# Altium project MAX7219_PCB.PrjPCB
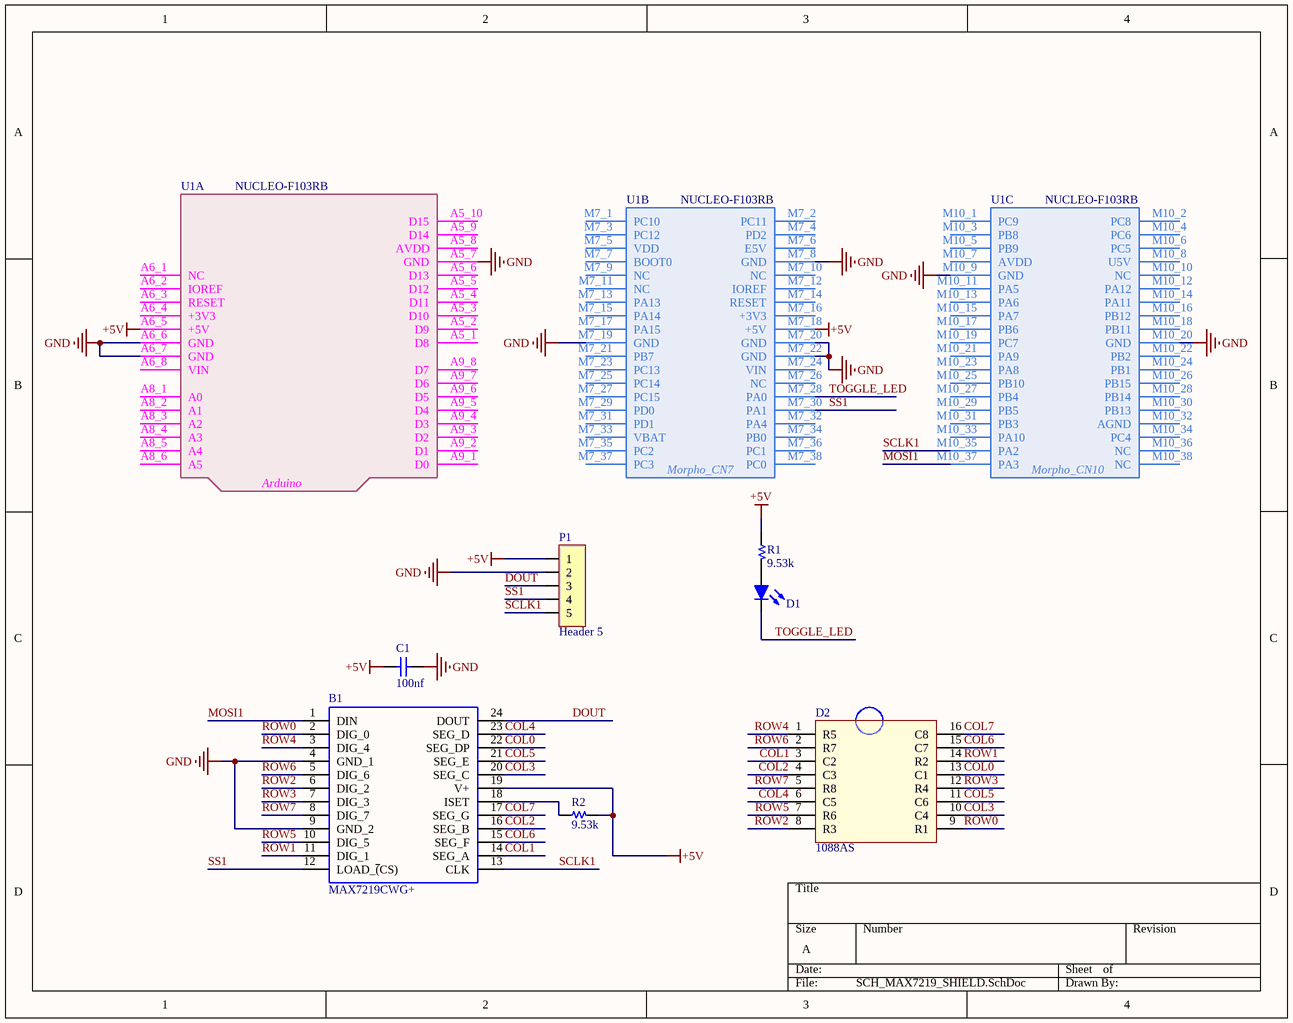
[diagram p0: SCH_MAX7219_SHIELD.SchDoc]
1 sheet, 8 parts. Net scope: global (net labels, ports and power ports of the same name join across sheets).
Board file: PCB_MAX7219_SHIELD.PcbDoc

## Sheet SCH_MAX7219_SHIELD.SchDoc
size A

### Parts
B1  MAX7219CWG+  [SOIC127P1032X265-24N]
C1  100nf  [CAP Ceramic/W300]
D1  Led  [Led 0805]  (value not drawn)
D2  1088AS  [LED/MATRIX/1088]
P1  Header 5  [HDR/Header/5]
R1  9.53k  [R 0805]
R2  9.53k  [R 0805]
U1  NUCLEO-F103RB  [NUCLEO]  (parts A,B,C of 3)

### Nets
+5V: B1.19(V+) C1.2 P1.1 R1.1 R2.2 U1.A6_5(+5V) U1.M7_18(+5V)
GND: B1.4(GND_1) B1.9(GND_2) C1.1 P1.2 U1.A5_7(GND) U1.A6_6(GND) U1.A6_7(GND) U1.M7_8(GND) U1.M7_19(GND) U1.M7_20(GND) U1.M7_22(GND) U1.M10_9(GND) U1.M10_20(GND)
COL0: B1.22(SEG_DP) D2.13(C1)
COL1: B1.14(SEG_A) D2.3(C2)
COL2: B1.16(SEG_B) D2.4(C3)
COL3: B1.20(SEG_C) D2.10(C4)
COL4: B1.23(SEG_D) D2.6(C5)
COL5: B1.21(SEG_E) D2.11(C6)
COL6: B1.15(SEG_F) D2.15(C7)
COL7: B1.17(SEG_G) D2.16(C8)
DOUT: B1.24(DOUT) P1.3
MOSI1: B1.1(DIN) U1.M10_37(PA3)
ROW0: B1.2(DIG_0) D2.9(R1)
ROW1: B1.11(DIG_1) D2.14(R2)
ROW2: B1.6(DIG_2) D2.8(R3)
ROW3: B1.7(DIG_3) D2.12(R4)
ROW4: B1.3(DIG_4) D2.1(R5)
ROW5: B1.10(DIG_5) D2.7(R6)
ROW6: B1.5(DIG_6) D2.2(R7)
ROW7: B1.8(DIG_7) D2.5(R8)
SCLK1: B1.13(CLK) P1.5 U1.M10_35(PA2)
SS1: B1.12(LOAD_~{(}CS)) P1.4 U1.M7_30(PA1)
TOGGLE_LED: D1.2(K) U1.M7_28(PA0)
NetB1_18: B1.18(ISET) R2.1
NetD1_1: D1.1(A) R1.2

Not connected (* = marked no-connect by the designer): U1 A5_1(D8) A5_2(D9) A5_3(D10) A5_4(D11) A5_5(D12) A5_6(D13) A5_8(AVDD) A5_9(D14) A5_10(D15) A6_1(NC) A6_2(IOREF) A6_3(RESET) A6_4(+3V3) A6_8(VIN) A8_1(A0) A8_2(A1) A8_3(A2) A8_4(A3) A8_5(A4) A8_6(A5) A9_1(D0) A9_2(D1) A9_3(D2) A9_4(D3) A9_5(D4) A9_6(D5) A9_7(D6) A9_8(D7) M7_1(PC10) M7_2(PC11) M7_3(PC12) M7_4(PD2) M7_5(VDD) M7_6(E5V) M7_7(BOOT0) M7_9(NC) M7_10(NC) M7_11(NC) M7_12(IOREF) M7_13(PA13) M7_14(RESET) M7_15(PA14) M7_16(+3V3) M7_17(PA15) M7_21(PB7) M7_23(PC13) M7_24(VIN) M7_25(PC14) M7_26(NC) M7_27(PC15) M7_29(PD0) M7_31(PD1) M7_32(PA4) M7_33(VBAT) M7_34(PB0) M7_35(PC2) M7_36(PC1) M7_37(PC3) M7_38(PC0) M10_1(PC9) M10_2(PC8) M10_3(PB8) M10_4(PC6) M10_5(PB9) M10_6(PC5) M10_7(AVDD) M10_8(U5V) M10_10(NC) M10_11(PA5) M10_12(PA12) M10_13(PA6) M10_14(PA11) M10_15(PA7) M10_16(PB12) M10_17(PB6) M10_18(PB11) M10_19(PC7) M10_21(PA9) M10_22(PB2) M10_23(PA8) M10_24(PB1) M10_25(PB10) M10_26(PB15) M10_27(PB4) M10_28(PB14) M10_29(PB5) M10_30(PB13) M10_31(PB3) M10_32(AGND) M10_33(PA10) M10_34(PC4) M10_36(NC) M10_38(NC)

### Notes on the sheet
- (in symbol NUCLEO-F103RB, part A) Arduino
- (in symbol NUCLEO-F103RB, part B) Morpho_CN7
- (in symbol NUCLEO-F103RB, part C) Morpho_CN10

### Library data of the parts
B1 = MAX7219CWG+: MAX7219CWG+, LED Driver, 8-Digits 64-Segments, 5V, 24-Pin SOIC W; Manufacturer_Name: Maxim Integrated; Geometry.Height: 2.65mm; Manufacturer_Part_Number: MAX7219CWG+; Mouser Part Number: 700-MAX7219CWG; Mouser Price/Stock: https://www.mouser.co.uk/ProductDetail/Maxim-Integrated/MAX7219CWG%2b?qs=1THa7WoU59FAb2MozDF%2Fgw%3D%3D; Arrow Part Number: MAX7219CWG+; Arrow Price/Stock: https://www.arrow.com/en/products/max7219cwg/maxim-integrated?region=nac; Mouser Testing Part Number: *; Mouser Testing Price/Stock: *; Datasheet Link: http://datasheets.maximintegrated.com/en/ds/MAX7219-MAX7221.pdf
C1 = Capacitor NP: Capacitor non-pol
D1 = Led: Typical LED
D2 = LED MATRIX 1088AS: 1088AS, Common-Cathode, LED Matrix 8x8, RED, 32x32mm
P1 = Header 5: Header, 5-Pin
R1 R2 = Resistor
U1 = NUCLEO-F103RB: STM32F103RB, mbed-Enabled Development Nucleo-64 STM32F1 ARM® Cortex®-M3 MCU 32-Bit Embedded Evaluation Board; Manufacturer: STMicroelectronics; Manufacturer Product Number: NUCLEO-F103RB; BRAND: STMicroelectronics; PART NO: NUCLEO-F103RB; STOCK CODE: 497-14362-ND; SUPPLIER: digi-key; TYPE: EVAL BRD